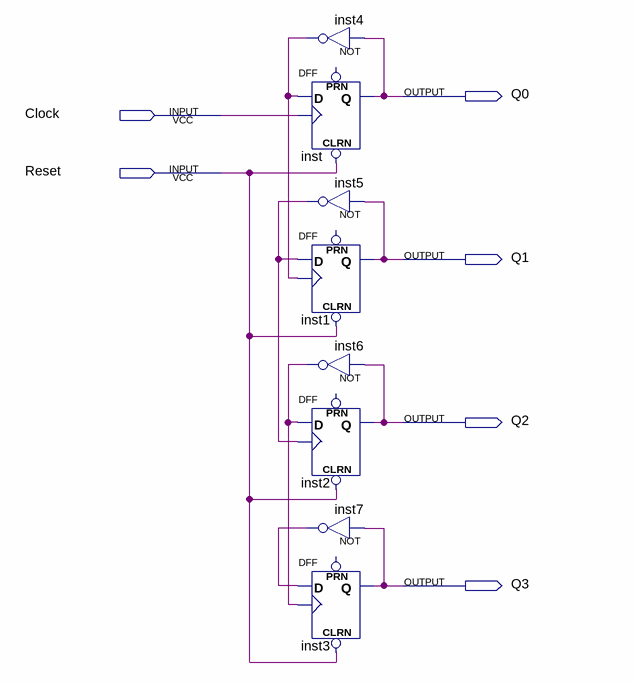
[diagram p0: schematic sheet]
// Quartus schematic Ripple4.bdf as structural Verilog: 8 symbols, 6 pins
module Ripple4 (
  input  Clock,
  input  Reset,
  output Q0,
  output Q1,
  output Q2,
  output Q3
);

  wire inst4_out, inst5_out, inst6_out, inst7_out;

  not inst4 (inst4_out, Q0);
  DFF inst (.CLRN(Reset), .CLK(Clock), .D(inst4_out), .Q(Q0));  // open: PRN
  not inst5 (inst5_out, Q1);
  DFF inst1 (.CLRN(Reset), .CLK(inst4_out), .D(inst5_out), .Q(Q1));  // open: PRN
  not inst6 (inst6_out, Q2);
  DFF inst2 (.CLRN(Reset), .CLK(inst5_out), .D(inst6_out), .Q(Q2));  // open: PRN
  not inst7 (inst7_out, Q3);
  DFF inst3 (.CLRN(Reset), .CLK(inst6_out), .D(inst7_out), .Q(Q3));  // open: PRN
endmodule
